# EAGLE design Game of Life Lg Screen_v1 (EAGLE 9.6.2)
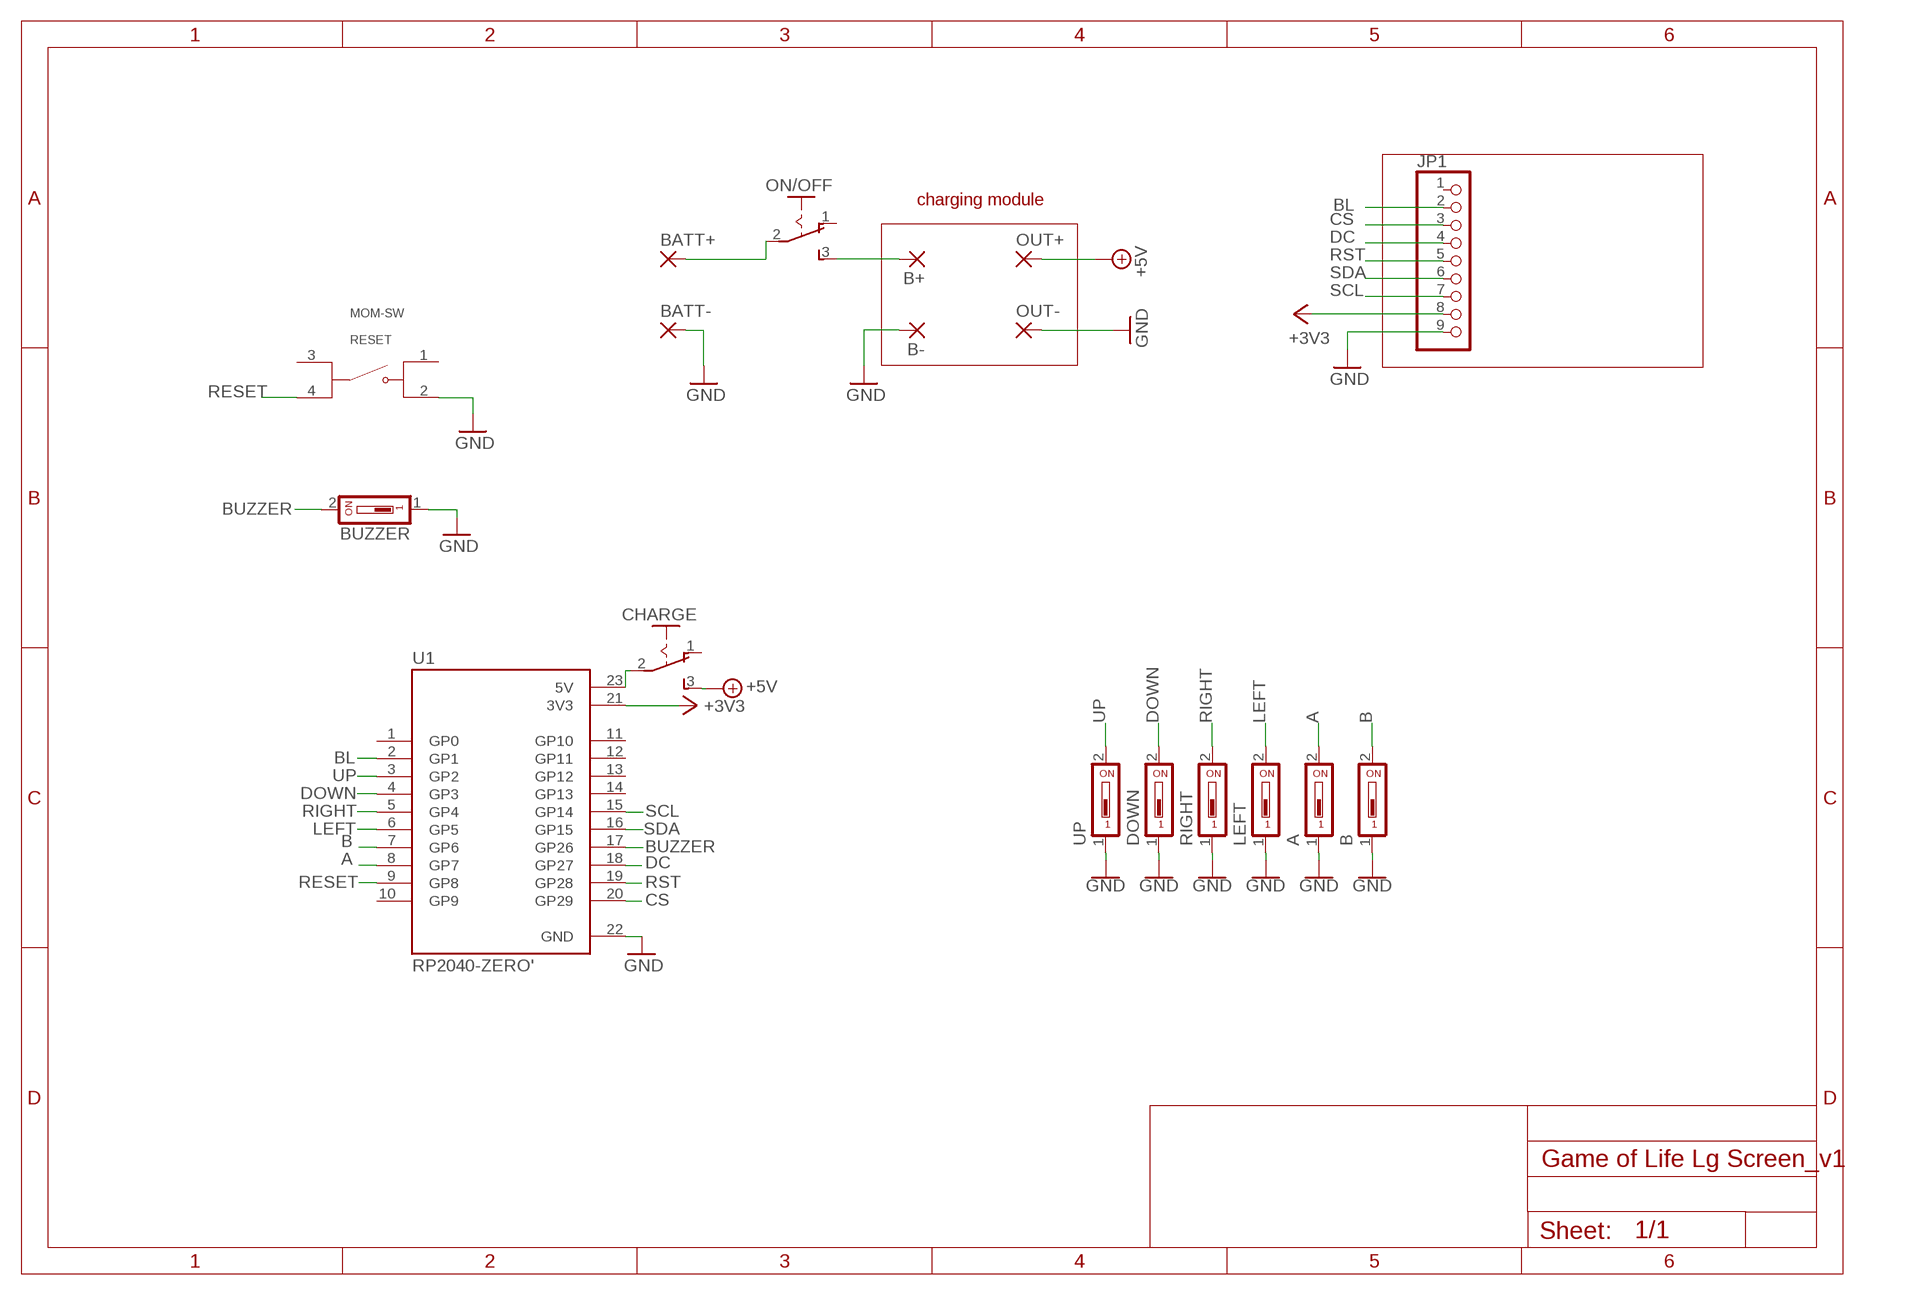
[diagram p0: schematic, sheet 1]

## Parts
A  DS01  [DS-01]
B  DS01  [DS-01]
B+  SMD5  [SMD2,54-5,08]
B-  SMD5  [SMD2,54-5,08]
BATT+  SMD5  [SMD2,54-5,08]
BATT-  SMD5  [SMD2,54-5,08]
BUZZER  DS01  [DS-01]
CHARGE  M251  [M251]
DOWN  DS01  [DS-01]
JP1  PINHD-1X9  [1X09]
LEFT  DS01  [DS-01]
ON/OFF  M251  [M251]
OUT+  SMD5  [SMD2,54-5,08]
OUT-  SMD5  [SMD2,54-5,08]
RESET  MOM-SW  TS18-5-25-SL-260-SMT-TR  [SW_TS18-5-25-SL-260-SMT-TR]
RIGHT  DS01  [DS-01]
U1  RP2040-ZERO'  [MODULE_RP2040-ZERO]
UP  DS01  [DS-01]

## Nets
+3V3: JP1.8 U1.21(3V3)
+5V: CHARGE.3(S) OUT+.1(P)
A: A.2 U1.8(GP7)
B: B.2 U1.7(GP6)
BL: JP1.2 U1.2(GP1)
BUZZER: BUZZER.2 U1.17(GP26)
CS: JP1.3 U1.20(GP29)
DC: JP1.4 U1.18(GP27)
DOWN: DOWN.2 U1.4(GP3)
GND: A.1 B-.1(P) B.1 BATT-.1(P) BUZZER.1 DOWN.1 JP1.9 LEFT.1 OUT-.1(P) RESET.2 RIGHT.1 U1.22(GND) UP.1
LEFT: LEFT.2 U1.6(GP5)
N$1: B+.1(P) ON/OFF.3(S)
N$3: CHARGE.2(P) U1.23(5V)
N$8: BATT+.1(P) ON/OFF.2(P)
RESET: RESET.4 U1.9(GP8)
RIGHT: RIGHT.2 U1.5(GP4)
RST: JP1.5 U1.19(GP28)
SCL: JP1.7 U1.15(GP14)
SDA: JP1.6 U1.16(GP15)
UP: U1.3(GP2) UP.2
Unconnected: CHARGE.1(O) JP1.1 ON/OFF.1(O) RESET.1 RESET.3 U1.1(GP0) U1.10(GP9) U1.11(GP10) U1.12(GP11) U1.13(GP12) U1.14(GP13)

## Notes on the sheet
- charging module

## Library data of the parts
A B DOWN LEFT RIGHT UP = 5mm SPST Switch:DS01: DIL/CODE SWITCH; OC_FARNELL: unknown; OC_NEWARK: unknown
B+ B- BATT+ BATT- OUT+ OUT- = wirepad:SMD5: SMD PAD
BUZZER = buzzer:DS01: DIL/CODE SWITCH; OC_FARNELL: unknown; OC_NEWARK: unknown
CHARGE ON/OFF = switches M Dunn:M251: SLIDING SWITCH Mors, distributor Buerklin, 11G702
JP1 = pinhead:PINHD-1X9: PIN HEADER
RESET = TS18-5-25-SL-260-SMT-TR:TS18-5-25-SL-260-SMT-TR: Check availability <https://pricing.snapeda.com/parts/TS18-5-25-SL-260-SMT-TR/Same%20Sky/view-part?ref=eda>; AVAILABILITY: In Stock; CHECK_PRICES: https://www.snapeda.com/parts/TS18-5-25-SL-260-SMT-TR/Same+Sky/view-part/?ref=eda; DESCRIPTION: 5 x 5 mm, 2.5 mm Actuator Height, 260 gf, Silver, Surface Mount, TR, SPST, Tactile Switch; MF: Same Sky; MP: TS18-5-25-SL-260-SMT-TR; PACKAGE: None; PRICE: None; SNAPEDA_LINK: https://www.snapeda.com/parts/TS18-5-25-SL-260-SMT-TR/Same+Sky/view-part/?ref=snap
U1 = RP2040-ZERO:RP2040-ZERO: Check availability <https://pricing.snapeda.com/parts/RP2040-ZERO/Waveshare%20Electronics/view-part?ref=eda>; AVAILABILITY: Not in stock; CHECK_PRICES: https://www.snapeda.com/parts/RP2040-ZERO/Waveshare+Electronics/view-part/?ref=eda; DESCRIPTION: Low-Cost, High-Performance Pico-Like MCU Board Based On Raspberry Pi Microcontroller RP2040; MF: Waveshare Electronics; MP: RP2040-ZERO; PACKAGE: Package; PRICE: None; SNAPEDA_LINK: https://www.snapeda.com/parts/RP2040-ZERO/Waveshare+Electronics/view-part/?ref=snap

## Board
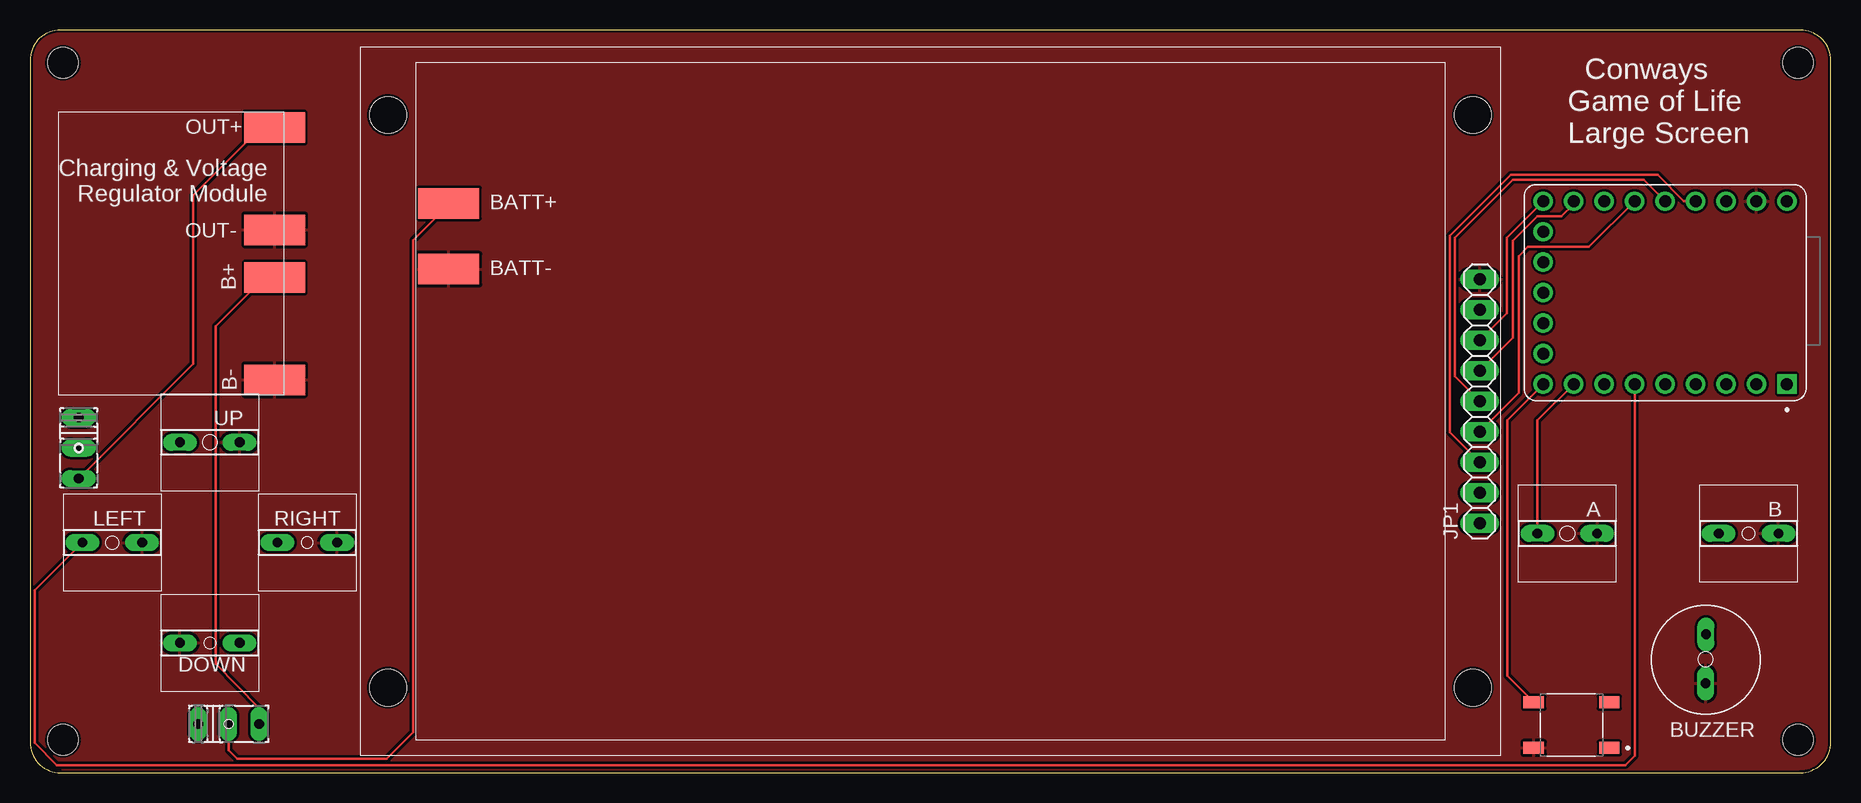
[diagram p1: board, top side]
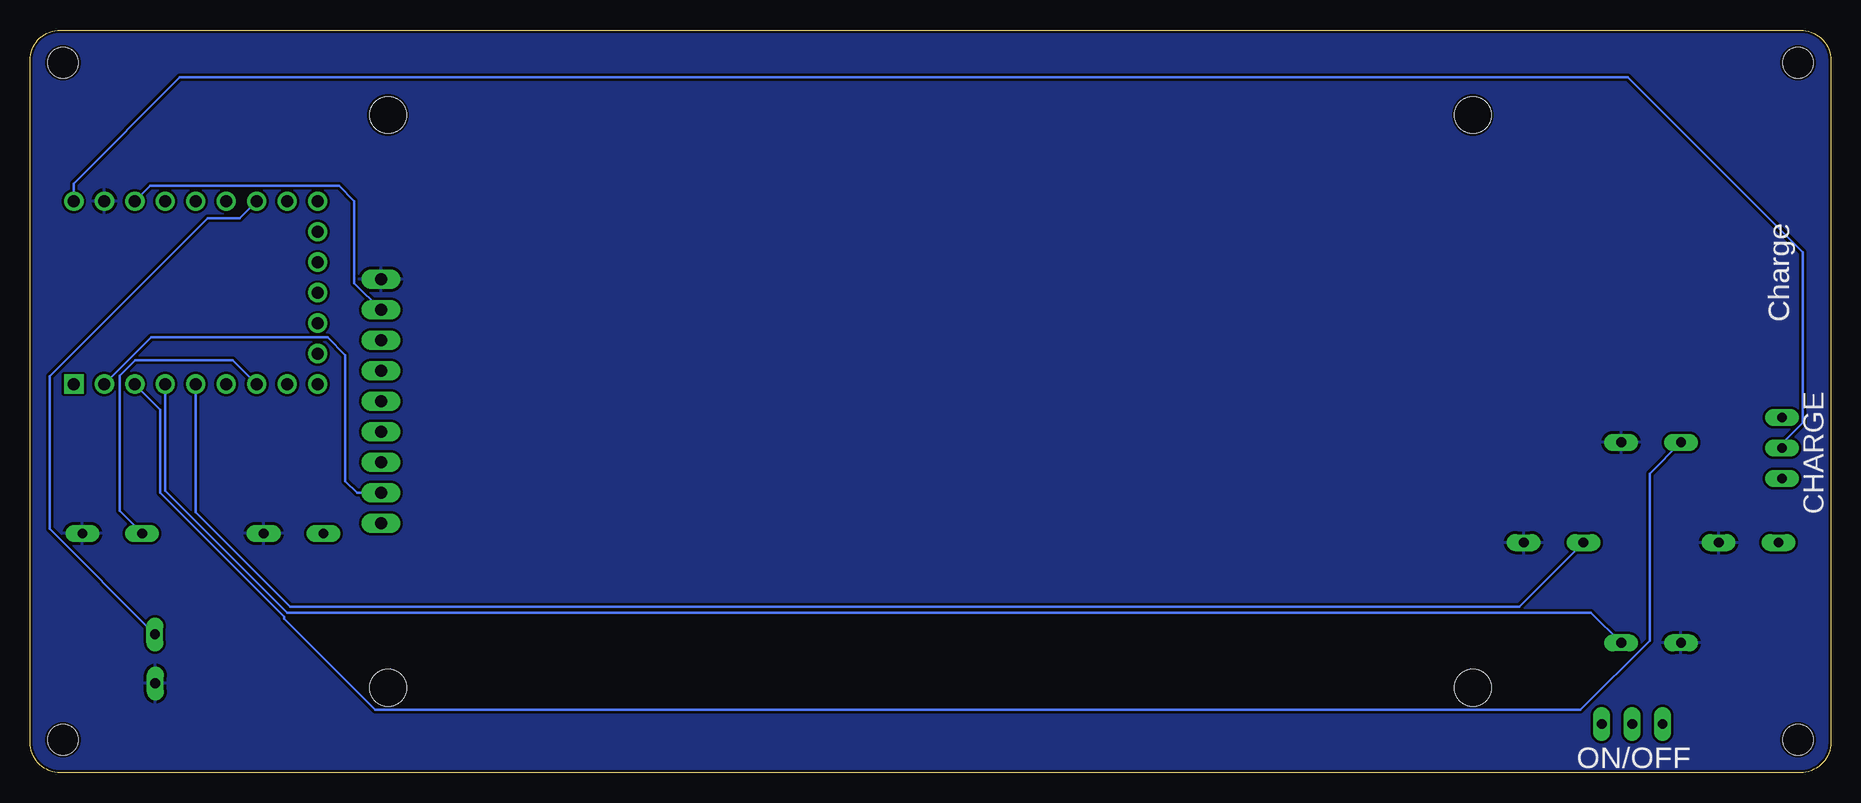
[diagram p2: board, bottom side, seen from below]

Size 150.11 x 61.89 mm. Coordinates in mm from the lower left corner, seen from the top.
Outline: 147.57,61.89 2.54,61.89 arc90 0,59.35 0,2.54 arc90 2.54,0 147.57,0 arc90 150.11,2.54 150.11,59.35 arc90 147.57,61.89
Copper layers (1*16): Top 0.035mm / dielectric 1.5mm / Bottom 0.035mm
Design rules "SparkFun": minimum track width 8mil, minimum drill 20mil, track to track 8mil, track to pad 8mil, pad to pad 8mil, via to via 8mil, smd to smd 8mil, copper to edge 8mil, drill to drill 8mil, minimum pad ring 12mil, minimum via ring 10mil, stop-mask expansion 4mil, vias tented up to drill 20mil, thermal gap 10mil
Holes 2.54 mm at 2.74,2.74 147.37,2.74 147.37,59.16 2.74,59.16
Holes 3.05 mm at 29.84,54.81 29.84,7.09 120.27,7.09 120.27,54.81

### Footprints (pad centres in the part's own frame; a part is rotated, then mirrored left to right if it is on the bottom)
DS-01 = drill 0.813 long: 1 2.489,0; 2 -2.489,0
SMD2,54-5,08 = smd 2.54 x 5.08: 1 0,0
DS-01' = drill 0.813 long: 1 0,-1.981; 2 0.025,2.108
M251 = drill 0.813 long: 1 -2.54,0; 2 0,0; 3 2.54,0
1X09 = drill 1.016 long: 1 -10.16,0; 2 -7.62,0; 3 -5.08,0; 4 -2.54,0; 5 0,0; 6 2.54,0; 7 5.08,0; 8 7.62,0; 9 10.16,0
SW_TS18-5-25-SL-260-SMT-TR = smd 1.7 x 1: 1 -3.15,1.9; 2 3.15,1.9; 3 -3.15,-1.9; 4 3.15,-1.9
MODULE_RP2040-ZERO = drill 1 square: 1 7.62,10.16 | drill 1: 2 7.62,7.62; 3 7.62,5.08; 4 7.62,2.54; 5 7.62,0; 6 7.62,-2.54; 7 7.62,-5.08; 8 7.62,-7.62; 9 7.62,-10.16; 10 5.08,-10.16; 11 2.54,-10.16; 12 0,-10.16; 13 -2.54,-10.16; 14 -5.08,-10.16; 15 -7.62,-10.16; 16 -7.62,-7.62; 17 -7.62,-5.08; 18 -7.62,-2.54; 19 -7.62,0; 20 -7.62,2.54; 21 -7.62,5.08; 22 -7.62,7.62; 23 -7.62,10.16

### Placement (x,y rotation side)
A  128.14,19.94 0 top
B  143.26,19.94 0 top
B+  20.4,41.25 270 top
B-  20.4,32.74 270 top
BATT+  34.91,47.45 90 top
BATT-  34.91,41.96 90 top
BUZZER  [DS-01']  139.67,9.42 0 top
CHARGE  4.06,27.05 270 top
DOWN  14.99,10.82 180 top
JP1  120.85,30.95 90 top
LEFT  6.86,19.18 0 top
ON/OFF  16.56,4.06 0 top
OUT+  20.4,53.75 90 top
OUT-  20.4,45.24 270 top
RESET  128.5,3.96 180 top
RIGHT  23.11,19.18 0 top
U1  136.3,40.01 270 top
UP  14.99,27.53 0 top

### Tracks (layer width: path | path; a pad name or v marks a point on that pad's centre or on a via)
+3V3
  Bottom 0.203: JP1.8 123.09,40.8 123.09,47.62 124.36,48.9 140.11,48.9 U1.21
+5V
  Top 0.203: OUT+.1 20.4,53.72 19.2,53.72 13.61,48.13 13.61,34.06 CHARGE.3
A
  Top 0.203: A.2 125.65,29.36 U1.8
B
  Bottom 0.203: U1.7 133.22,34.38 141.34,34.38 142.65,33.08 142.65,21.82 B.2
BL
  Bottom 0.203: JP1.2 122.86,23.33 123.83,24.3 123.83,34.79 125.31,36.27 140.03,36.27 U1.2
BUZZER
  Bottom 0.203: U1.17 132.64,46.2 135.31,46.2 148.49,33.02 148.49,20.32 BUZZER.2
CS
  Top 0.203: U1.20 137.87,47.62 135.68,49.81 123.43,49.81 118.36,44.74 118.36,28.36 JP1.3
DC
  Top 0.203: JP1.4 124.1,31.66 124.1,43.05 124.87,43.81 129.95,43.81 U1.18
DOWN
  Bottom 0.203: U1.4 138.84,23.5 128.68,13.34 19.99,13.34 DOWN.2
GND
  pour Top: -0.1,62.1 150.27,62.1 150.27,-0.03 -0.1,-0.03
  pour Bottom: -0.1,62.1 150.27,62.1 150.27,0.13 -0.1,0.13
LEFT
  Top 0.203: U1.6 133.76,1.4 132.99,0.64 2.24,0.64 0.38,2.49 0.38,15.19 LEFT.2
N$1
  Top 0.203: ON/OFF.3 19.1,5.36 15.47,9.06 15.47,37.21 19.51,41.25 B+.1
N$3
  Bottom 0.203: CHARGE.2 4.06,27.44 2.34,29.17 2.34,43.36 16.92,57.94 137.62,57.94 146.48,49.07 146.48,47.62 U1.23
N$8
  Top 0.203: BATT+.1 34.91,47.33 31.93,44.35 31.93,3.35 29.72,1.14 17.27,1.14 16.56,1.85 ON/OFF.2
RESET
  Top 0.203: RESET.4 123.14,8.07 123.14,29.39 U1.9
RIGHT
  Bottom 0.203: U1.5 136.3,21.72 128.42,13.84 25.96,13.84 RIGHT.2
RST
  Top 0.203: JP1.5 118.77,33.03 118.77,44.58 123.6,49.4 134.52,49.4 U1.19
SCL
  Top 0.203: JP1.7 123.09,38.27 123.09,44.58 U1.15
SDA
  Top 0.203: JP1.6 123.6,36.23 123.6,44.32 125.63,46.35 127.66,46.35 128.68,47.37 U1.16
UP
  Bottom 0.203: U1.3 139.24,30.25 139.24,23.33 128.93,13.01 128.93,12.83 121.36,5.26 20.87,5.26 15.11,11.01 15.11,24.92 UP.2

### Text on the board
tPlace: Conways / Game of Life / Large Screen | Charging & Voltage / Regulator Module
bPlace: Charge | CHARGE | ON/OFF